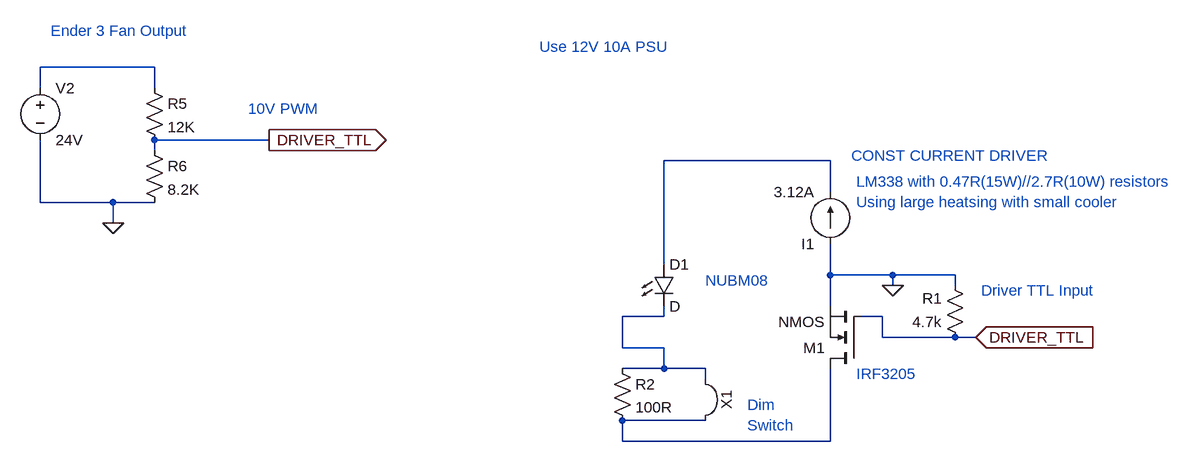
[diagram p0: schematic Ender 3 Laser Wiring v1.asc]
Ender 3 Laser Wiring v1.asc, the LTspice schematic file:
Version 4
SHEET 1 1132 680
WIRE -496 -352 -672 -352
WIRE -672 -320 -672 -352
WIRE -496 -320 -496 -352
WIRE -320 -240 -496 -240
WIRE -496 -224 -496 -240
WIRE 544 -208 288 -208
WIRE 544 -160 544 -208
WIRE -672 -144 -672 -240
WIRE -560 -144 -672 -144
WIRE -496 -144 -560 -144
WIRE -560 -112 -560 -144
WIRE 288 -48 288 -208
WIRE 544 -32 544 -80
WIRE 640 -32 544 -32
WIRE 736 -32 640 -32
WIRE 640 -16 640 -32
WIRE 736 -16 736 -32
WIRE 544 16 544 -32
WIRE 288 32 288 16
WIRE 288 32 224 32
WIRE 624 32 592 32
WIRE 624 64 624 32
WIRE 736 64 624 64
WIRE 768 64 736 64
WIRE 224 80 224 32
WIRE 288 80 224 80
WIRE 288 112 288 80
WIRE 288 112 224 112
WIRE 352 112 288 112
WIRE 352 128 352 112
WIRE 352 192 224 192
WIRE 224 224 224 192
WIRE 544 224 544 112
WIRE 544 224 224 224
FLAG -560 -112 0
FLAG -320 -240 DRIVER_TTL
IOPIN -320 -240 Out
FLAG 768 64 DRIVER_TTL
IOPIN 768 64 In
FLAG 640 -16 0
SYMBOL current 544 -80 R180
WINDOW 123 0 0 Left 0
WINDOW 39 0 0 Left 0
SYMATTR InstName I1
SYMATTR Value 3.12A
SYMBOL LED 272 -48 R0
SYMATTR InstName D1
SYMBOL res 208 96 R0
SYMATTR InstName R2
SYMATTR Value 100R
SYMATTR SpiceLine pwr=1
SYMBOL Misc\\jumper 416 160 R90
SYMATTR InstName X1
SYMBOL voltage -672 -336 R0
WINDOW 123 0 0 Left 0
WINDOW 39 0 0 Left 0
SYMATTR InstName V2
SYMATTR Value 24V
SYMBOL res -512 -336 R0
SYMATTR InstName R5
SYMATTR Value 12K
SYMBOL res -512 -240 R0
SYMATTR InstName R6
SYMATTR Value 8.2K
SYMBOL res 752 80 R180
WINDOW 0 36 76 Left 2
WINDOW 3 36 40 Left 2
SYMATTR InstName R1
SYMATTR Value 4.7k
SYMBOL nmos 592 112 R180
SYMATTR InstName M1
TEXT 416 168 Left 2 ;Dim\nSwitch
TEXT 584 -176 Left 2 ;LM338 with 0.47R(15W)//2.7R(10W) resistors\nUsing large heatsing with small cooler
TEXT 352 -24 Left 2 ;NUBM08
TEXT -656 -408 Left 2 ;Ender 3 Fan Output
TEXT -352 -288 Left 2 ;10V PWM
TEXT 96 -384 Left 2 ;Use 12V 10A PSU
TEXT 576 -216 Left 2 ;CONST CURRENT DRIVER
TEXT 952 -8 Right 2 ;Driver TTL Input
TEXT 584 120 Left 2 ;IRF3205

The netlist it stands for:
* Ender 3 Laser Wiring v1.asc
I1 0 N002 3.12A
D1 N002 N003 D
R2 N003 N003 100R pwr=1
V2 N001 0 24V
R5 N001 DRIVER_TTL 12K
R6 DRIVER_TTL 0 8.2K
R1 DRIVER_TTL 0 4.7k
M1 N003 DRIVER_TTL 0 0 NMOS
.model D D
.lib standard.dio
.model NMOS NMOS
.model PMOS PMOS
.lib standard.mos
* Dim
* Switch
* LM338 with 0.47R(15W)//2.7R(10W) resistors
* Using large heatsing with small cooler
* NUBM08
* Ender 3 Fan Output
* 10V PWM
* Use 12V 10A PSU
* CONST CURRENT DRIVER
* Driver TTL Input
* IRF3205
.backanno
.end